# Altium schematic sheet PGA.SchDoc: ThunderScope 1000E
size A4; DrawnBy: Aleksa Bjelogrlic; Revision: 1
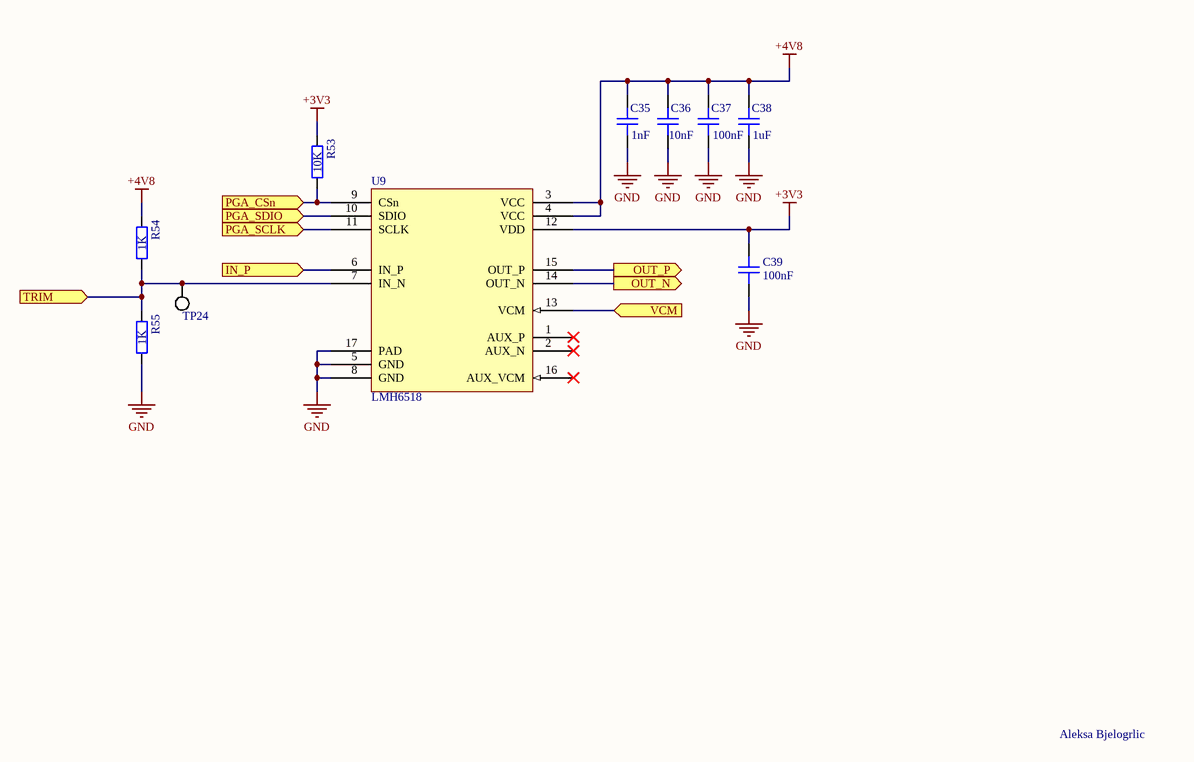
[diagram p0: PGA.SchDoc]

## Parts
C35  1nF  [GEN_C_0402]
C36  10nF  [GEN_C_0402]
C37  100nF  [GEN_C_0402]
C38  1uF  [GEN_C_0402]
C39  100nF  [GEN_C_0402]
R53  10K  [GEN_R_0402]
R54  1K  [GEN_R_0402]
R55  1K  [GEN_R_0402]
TP24  PCB  [GEN_TP_PCB]  (value not drawn)  (no BOM)
U9  LMH6518  [TI_WQFN_RGH0016A]

## Ports
IN_P (in), OUT_N (out), OUT_P (out), PGA_CSn (in), PGA_SCLK (in), PGA_SDIO (in), TRIM (in), VCM (in)

## Nets
+3V3: C39.2 R53.2 U9.12(VDD)
+4V8: C35.2 C36.2 C37.2 C38.2 R54.2 U9.3(VCC) U9.4(VCC)
GND: C35.1 C36.1 C37.1 C38.1 C39.1 R55.1 U9.5(GND) U9.8(GND) U9.17(PAD)
IN_P: U9.6(IN_P) ; port IN_P
OUT_N: U9.14(OUT_N) ; port OUT_N
OUT_P: U9.15(OUT_P) ; port OUT_P
PGA_CSn: R53.1 U9.9(CSn) ; port PGA_CSn
PGA_SCLK: U9.11(SCLK) ; port PGA_SCLK
PGA_SDIO: U9.10(SDIO) ; port PGA_SDIO
TRIM: R54.1 R55.2 TP24.1 U9.7(IN_N) ; port TRIM
VCM: U9.13(VCM) ; port VCM

Not connected (* = marked no-connect by the designer): U9 1(AUX_P)* 2(AUX_N)* 16(AUX_VCM)*

## Notes on the sheet
- Aleksa Bjelogrlic

## Library data of the parts
C35 = CAP 1nF 50V C0G 0402: Voltage Rating: 50V; Package: 0402; Supplier 1: Digi-Key; Supplier Part Number 1: 490-6189-1-ND; Value: 1nF
C36 = CAP 10nF 50V X7R 0402: Voltage Rating: 50V; Package: 0402; Supplier 1: Digi-Key; Supplier Part Number 1: 490-6351-1-ND; Value: 10nF
C37 C39 = CAP 100nF 16V X7R 0402: Voltage Rating: 16V; Package: 0402; Supplier 1: Digi-Key; Supplier Part Number 1: 490-4759-1-ND; Value: 100nF
C38 = CAP 1uF 25V X5R 0402: Voltage Rating: 25V; Package: 0402; Supplier 1: Digi-Key; Supplier Part Number 1: 490-10017-1-ND; Value: 1uF
R53 = RES 10K OHM 1% 1/10W 0402: Tolerance: 1%; Power Rating: 0.1W; Package: 0402; Supplier 1: Digi-Key; Supplier Part Number 1: P10.0KLCT-ND; Value: 10K
R54 R55 = RES 1K OHM 1% 1/10W 0402: Tolerance: 1%; Power Rating: 0.1W; Package: 0402; Supplier 1: Digi-Key; Supplier Part Number 1: 311-1.00KLRCT-ND; Value: 1K
TP24 = TP PCB 1mm
U9 = IC PGA LMH6518: Supplier 1: Digi-Key; Supplier Part Number 1: LMH6518SQE/NOPBCT-ND